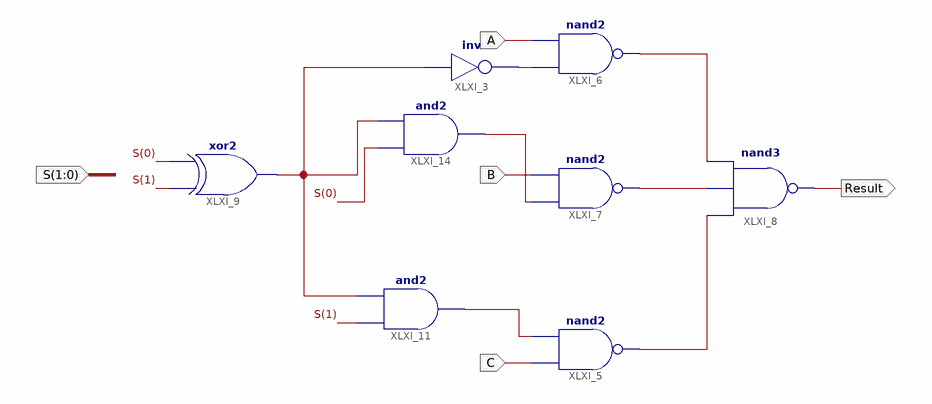
[diagram p0: schematic sheet 1]
// Xilinx ISE schematic mux3b1.sch (spartan3e) as structural Verilog: 8 symbols, 5 ports
module mux3b1 (
  input  A,
  input  B,
  input  C,
  input  [1:0] S,
  output Result
);

  wire XLXN_19, XLXN_20, XLXN_33, XLXN_34, XLXN_35, XLXN_37, XLXN_38;

  not XLXI_3 (XLXN_20, XLXN_38);
  nand XLXI_5 (XLXN_35, C, XLXN_19);
  nand XLXI_6 (XLXN_34, XLXN_20, A);
  nand XLXI_7 (XLXN_33, XLXN_37, B);
  nand XLXI_8 (Result, XLXN_35, XLXN_33, XLXN_34);
  xor XLXI_9 (XLXN_38, S[1], S[0]);
  and XLXI_11 (XLXN_19, S[1], XLXN_38);
  and XLXI_14 (XLXN_37, S[0], XLXN_38);
endmodule
